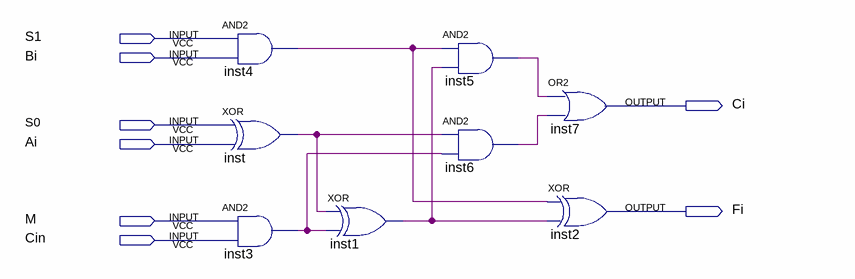
[diagram p0: schematic sheet]
// Quartus schematic ula.bdf as structural Verilog: 8 symbols, 8 pins
module ula (
  input  S1,
  input  Bi,
  input  S0,
  input  Ai,
  input  M,
  input  Cin,
  output Ci,
  output Fi
);

  wire inst1_out, inst3_out, inst4_out, inst5_out, inst6_out, inst_out;

  and inst4 (inst4_out, S1, Bi);
  xor inst (inst_out, S0, Ai);
  and inst3 (inst3_out, M, Cin);
  xor inst1 (inst1_out, inst_out, inst3_out);
  and inst5 (inst5_out, inst4_out, inst1_out);
  and inst6 (inst6_out, inst_out, inst3_out);
  or inst7 (Ci, inst5_out, inst6_out);
  xor inst2 (Fi, inst4_out, inst1_out);
endmodule
